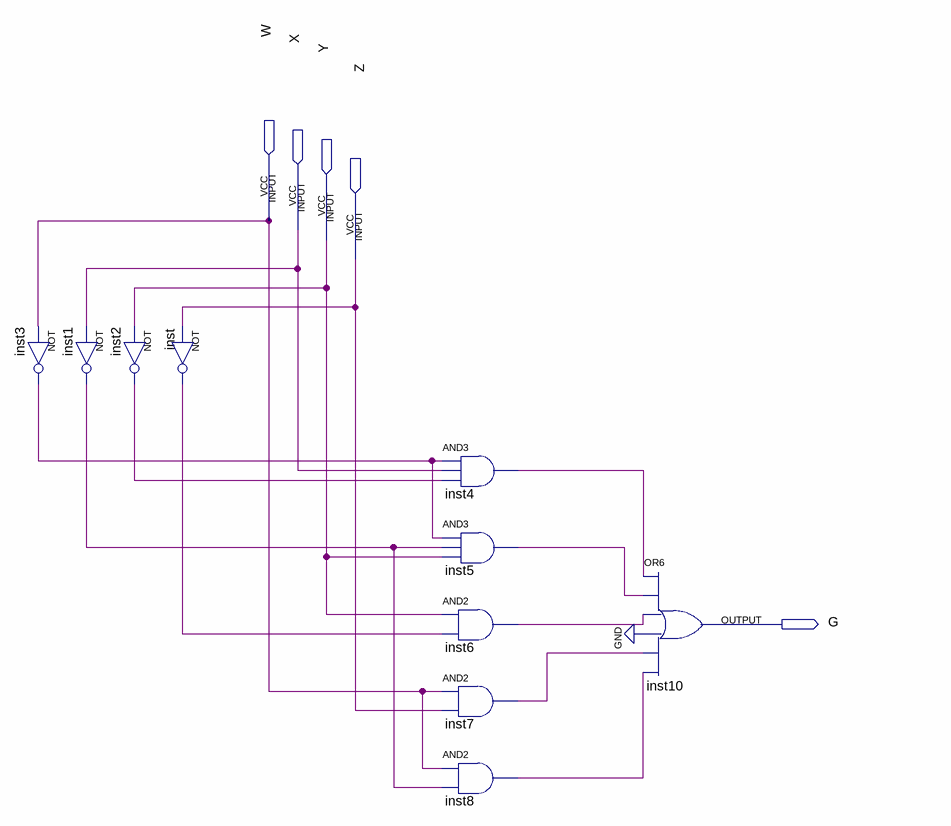
[diagram p0: schematic sheet]
// Quartus schematic SEG_G.bdf as structural Verilog: 10 symbols, 5 pins
module SEG_G (
  input  W,
  input  X,
  input  Y,
  input  Z,
  output G
);

  wire inst1_out, inst2_out, inst3_out, inst4_out, inst5_out, inst6_out, inst7_out, inst8_out, inst_out;

  not inst3 (inst3_out, W);
  not inst1 (inst1_out, X);
  not inst2 (inst2_out, Y);
  not inst (inst_out, Z);
  and inst4 (inst4_out, inst3_out, X, inst2_out);
  and inst5 (inst5_out, inst3_out, inst1_out, Y);
  and inst6 (inst6_out, Y, inst_out);
  and inst7 (inst7_out, W, Z);
  and inst8 (inst8_out, W, inst1_out);
  or inst10 (G, inst4_out, inst5_out, inst6_out, 1'b0, inst7_out, inst8_out);
endmodule
